# EAGLE design M105C (EAGLE 6.6.0)
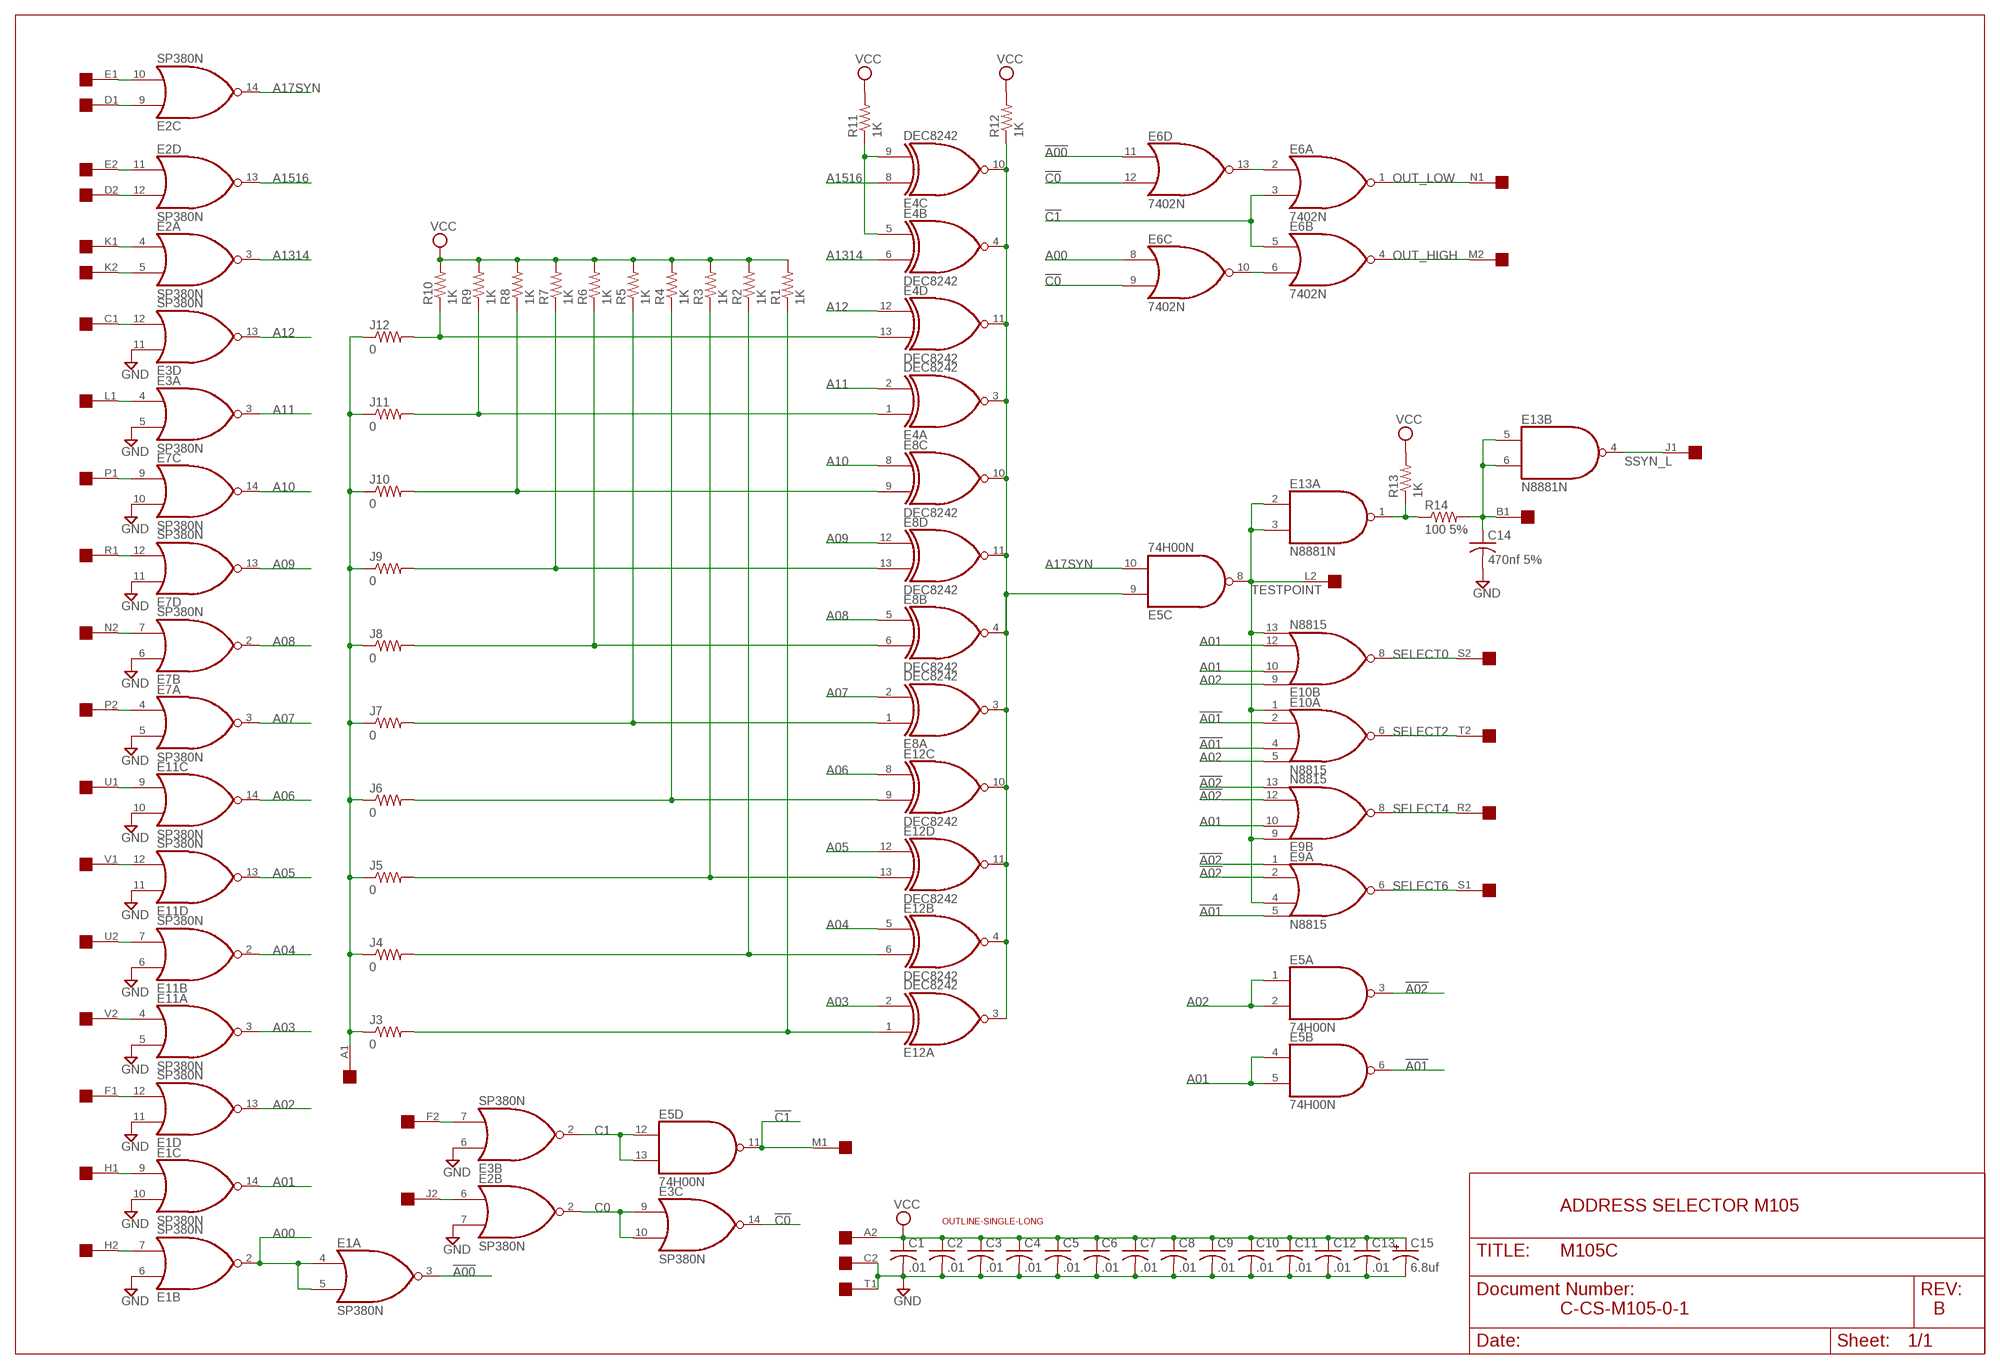
[diagram p0: schematic, sheet 1]

## Parts
C1  .01  C-US050-025X075  [C050-025X075]
C2  .01  C-US050-025X075  [C050-025X075]
C3  .01  C-US050-025X075  [C050-025X075]
C4  .01  C-US050-025X075  [C050-025X075]
C5  .01  C-US050-025X075  [C050-025X075]
C6  .01  C-US050-025X075  [C050-025X075]
C7  .01  C-US050-025X075  [C050-025X075]
C8  .01  C-US050-025X075  [C050-025X075]
C9  .01  C-US050-025X075  [C050-025X075]
C10  .01  C-US050-025X075  [C050-025X075]
C11  .01  C-US050-025X075  [C050-025X075]
C12  .01  C-US050-025X075  [C050-025X075]
C13  .01  C-US050-025X075  [C050-025X075]
C14  470nf 5%  C-US050-025X075  [C050-025X075]
C15  6.8uf  CPOL-USE15-5AXIAL  [E15-5]
E1  SP380N  [DIL14]
E2  SP380N  [DIL14]
E3  SP380N  [DIL14]
E4  DEC8242  74LS266N  [DIL14]
E5  74H00N  74S00N  [DIL14]
E6  7402N  [DIL14]
E7  SP380N  [DIL14]
E8  DEC8242  74LS266N  [DIL14]
E9  N8815  [DIL14]
E10  N8815  [DIL14]
E11  SP380N  [DIL14]
E12  DEC8242  74LS266N  [DIL14]
E13  N8881N  [DIL14]
J3  0  R-US_0207/10  [0207/10]
J4  0  R-US_0207/10  [0207/10]
J5  0  R-US_0207/10  [0207/10]
J6  0  R-US_0207/10  [0207/10]
J7  0  R-US_0207/10  [0207/10]
J8  0  R-US_0207/10  [0207/10]
J9  0  R-US_0207/10  [0207/10]
J10  0  R-US_0207/10  [0207/10]
J11  0  R-US_0207/10  [0207/10]
J12  0  R-US_0207/10  [0207/10]
R1  1K  R-US_0207/10  [0207/10]
R2  1K  R-US_0207/10  [0207/10]
R3  1K  R-US_0207/10  [0207/10]
R4  1K  R-US_0207/10  [0207/10]
R5  1K  R-US_0207/10  [0207/10]
R6  1K  R-US_0207/10  [0207/10]
R7  1K  R-US_0207/10  [0207/10]
R8  1K  R-US_0207/10  [0207/10]
R9  1K  R-US_0207/10  [0207/10]
R10  1K  R-US_0207/10  [0207/10]
R11  1K  R-US_0207/10  [0207/10]
R12  1K  R-US_0207/10  [0207/10]
R13  1K  R-US_0207/10  [0207/10]
R14  100 5%  R-US_0207/10  [0207/10]
U$1  SINGLE  [EDGE-CON2]
U$2  OUTLINE-SINGLE-LONG  [SINGLE-LONG]

## Nets
!A00: E1.3(A:O) E6.11(D:I0)
!A01: E5.6(B:O) E9.5(A:I3) E10.2(A:I1) E10.4(A:I2)
!A02: E5.3(A:O) E9.1(A:I0) E9.2(A:I1) E9.12(B:I2) E9.13(B:I3)
!C0: E3.14(C:O) E6.9(C:I1) E6.12(D:I1)
!C1: E5.11(D:O) E6.3(A:I1) E6.5(B:I0) U$1.M1
A00: E1.2(B:O) E1.4(A:I0) E1.5(A:I1) E6.8(C:I0)
A01: E1.14(C:O) E5.4(B:I0) E5.5(B:I1) E9.10(B:I1) E10.10(B:I1) E10.12(B:I2)
A02: E1.13(D:O) E5.1(A:I0) E5.2(A:I1) E10.5(A:I3) E10.9(B:I0)
A03: E11.3(A:O) E12.2(A:I1)
A04: E11.2(B:O) E12.5(B:I0)
A05: E11.13(D:O) E12.12(D:I0)
A06: E11.14(C:O) E12.8(C:I0)
A07: E7.3(A:O) E8.2(A:I1)
A08: E7.2(B:O) E8.5(B:I0)
A09: E7.13(D:O) E8.12(D:I0)
A10: E7.14(C:O) E8.8(C:I0)
A11: E3.3(A:O) E4.2(A:I1)
A12: E3.13(D:O) E4.12(D:I0)
A17SYN: E2.14(C:O) E5.10(C:I1)
A1314: E2.3(A:O) E4.6(B:I1)
A1516: E2.13(D:O) E4.8(C:I0)
C0: E2.2(B:O) E3.9(C:I0) E3.10(C:I1)
C1: E3.2(B:O) E5.12(D:I0) E5.13(D:I1)
GND [Supply]: C1.2 C2.2 C3.2 C4.2 C5.2 C6.2 C7.2 C8.2 C9.2 C10.2 C11.2 C12.2 C13.2 C14.2 C15.- E1.6(B:I0) E1.10(C:I1) E1.11(D:I0) E2.7(B:I1) E3.5(A:I1) E3.6(B:I0) E3.11(D:I0) E7.5(A:I1) E7.6(B:I0) E7.10(C:I1) E7.11(D:I0) E11.5(A:I1) E11.6(B:I0) E11.10(C:I1) E11.11(D:I0) U$1.C2 U$1.T1
N$1: E2.10(C:I1) U$1.E1
N$2: E2.9(C:I0) U$1.D1
N$3: E2.11(D:I0) U$1.E2
N$4: E2.12(D:I1) U$1.D2
N$5: E2.4(A:I0) U$1.K1
N$6: E2.5(A:I1) U$1.K2
N$7: E3.12(D:I1) U$1.C1
N$8: E3.4(A:I0) U$1.L1
N$9: E7.9(C:I0) U$1.P1
N$10: E7.7(B:I1) U$1.N2
N$11: E7.12(D:I1) U$1.R1
N$12: E7.4(A:I0) U$1.P2
N$13: E11.9(C:I0) U$1.U1
N$14: E11.12(D:I1) U$1.V1
N$15: E11.7(B:I1) U$1.U2
N$16: E11.4(A:I0) U$1.V2
N$17: E1.12(D:I1) U$1.F1
N$18: E1.7(B:I1) U$1.H2
N$19: E1.9(C:I0) U$1.H1
N$20: J3.1 J4.1 J5.1 J6.1 J7.1 J8.1 J9.1 J10.1 J11.1 J12.1 U$1.A1
N$21: E4.13(D:I1) J12.2 R10.1
N$22: E13.1(A:O) R13.1 R14.1
N$23: E2.6(B:I0) U$1.J2
N$24: E3.7(B:I1) U$1.F2
N$31: E4.1(A:I0) J11.2 R9.1
N$32: E4.5(B:I0) E4.9(C:I1) R11.1
N$33: E12.1(A:I0) J3.2 R1.1
N$34: E12.6(B:I1) J4.2 R2.1
N$35: E12.13(D:I1) J5.2 R3.1
N$36: E12.9(C:I1) J6.2 R4.1
N$37: E8.6(B:I1) J8.2 R6.1
N$38: E6.2(A:I0) E6.13(D:O)
N$39: E8.13(D:I1) J9.2 R7.1
N$40: E8.9(C:I1) J10.2 R8.1
N$41: E6.6(B:I1) E6.10(C:O)
N$43: E4.3(A:O) E4.4(B:O) E4.10(C:O) E4.11(D:O) E5.9(C:I0) E8.3(A:O) E8.4(B:O) E8.10(C:O) E8.11(D:O) E12.3(A:O) E12.4(B:O) E12.10(C:O) E12.11(D:O) R12.1
N$44: C14.1 E13.5(B:I0) E13.6(B:I1) R14.2 U$1.B1
N$48: E8.1(A:I0) J7.2 R5.1
OUT_HIGH: E6.4(B:O) U$1.M2
OUT_LOW: E6.1(A:O) U$1.N1
SELECT0: E10.8(B:O) U$1.S2
SELECT2: E10.6(A:O) U$1.T2
SELECT4: E9.8(B:O) U$1.R2
SELECT6: E9.6(A:O) U$1.S1
SSYN_L: E13.4(B:O) U$1.J1
TESTPOINT: E5.8(C:O) E9.4(A:I2) E9.9(B:I0) E10.1(A:I0) E10.13(B:I3) E13.2(A:I0) E13.3(A:I1) U$1.L2
VCC [Supply]: C1.1 C2.1 C3.1 C4.1 C5.1 C6.1 C7.1 C8.1 C9.1 C10.1 C11.1 C12.1 C13.1 C15.+ R1.2 R2.2 R3.2 R4.2 R5.2 R6.2 R7.2 R8.2 R9.2 R10.2 R11.2 R12.2 R13.2 U$1.A2
Unconnected: E13.8(C:I0) E13.9(C:I1) E13.10(C:O) E13.11(D:I0) E13.12(D:I1) E13.13(D:O) U$1.B2

## Notes on the sheet
- ADDRESS SELECTOR M105
- C-CS-M105-0-1 | B

## Power pins joined to a net without a drawn wire
GND: E1.1(P:GND) E2.1(P:GND) E3.1(P:GND) E4.7(P:GND) E5.7(P:GND) E6.7(P:GND) E7.1(P:GND) E8.7(P:GND) E9.7(P:GND) E10.7(P:GND) E11.1(P:GND) E12.7(P:GND) E13.7(P:GND)
VCC: E1.8(P:VCC) E2.8(P:VCC) E3.8(P:VCC) E4.14(P:VCC) E5.14(P:VCC) E6.14(P:VCC) E7.8(P:VCC) E8.14(P:VCC) E9.14(P:VCC) E10.14(P:VCC) E11.8(P:VCC) E12.14(P:VCC) E13.14(P:VCC)

## Library data of the parts
C1-C14 = rcl:C-US: CAPACITOR, American symbol
C15 = rcl:CPOL-US: POLARIZED CAPACITOR, American symbol
E1-E3 E7 E11 = dec-con:SP380: Quad NOR gate (use 8640)
E4 E8 E12 = 74xx-us:74*266: Quadruple EXCLUSIVE-NOR (XNOR), open-collector
E5 = 74xx-us:74*00: Quad 2-input NAND gate
E6 = 74xx-us:74*02: Quad 2-input NOR gate
E9 E10 = dec-con:N8815: Dual 4 Input NOR Gate
E13 = dec-con:N8881: Quad 2-input NAND gate, open collector
J3-J12 R1-R14 = rcl:R-US_: RESISTOR, American symbol
U$1 = dec-con:SINGLE: Single-Height DEC board
U$2 = dec-con:OUTLINE-*: Board outlines for DEC boards.

## Net classes
1 Supply: width 0.813 mm

## Board
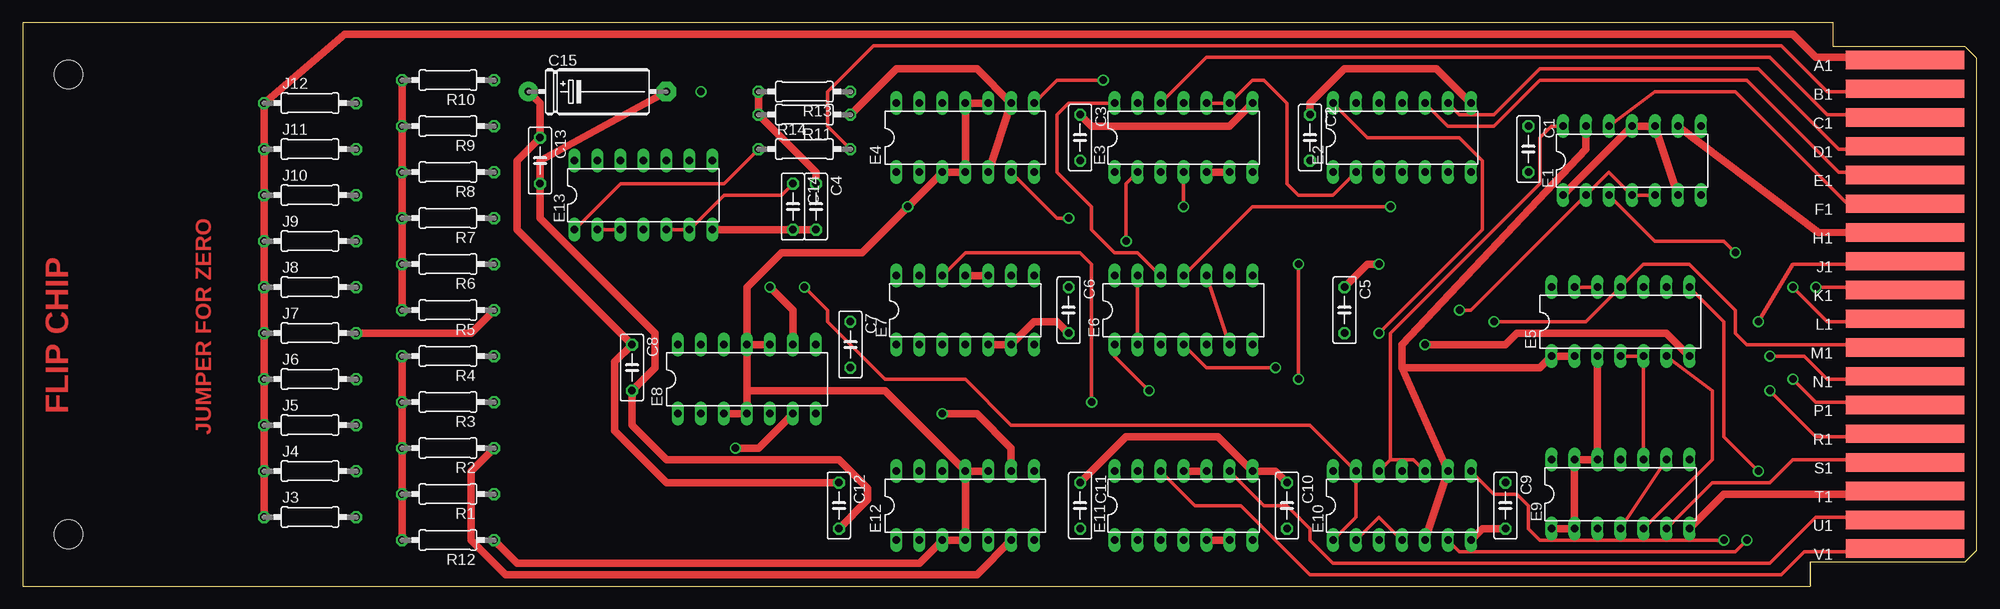
[diagram p1: board, top side]
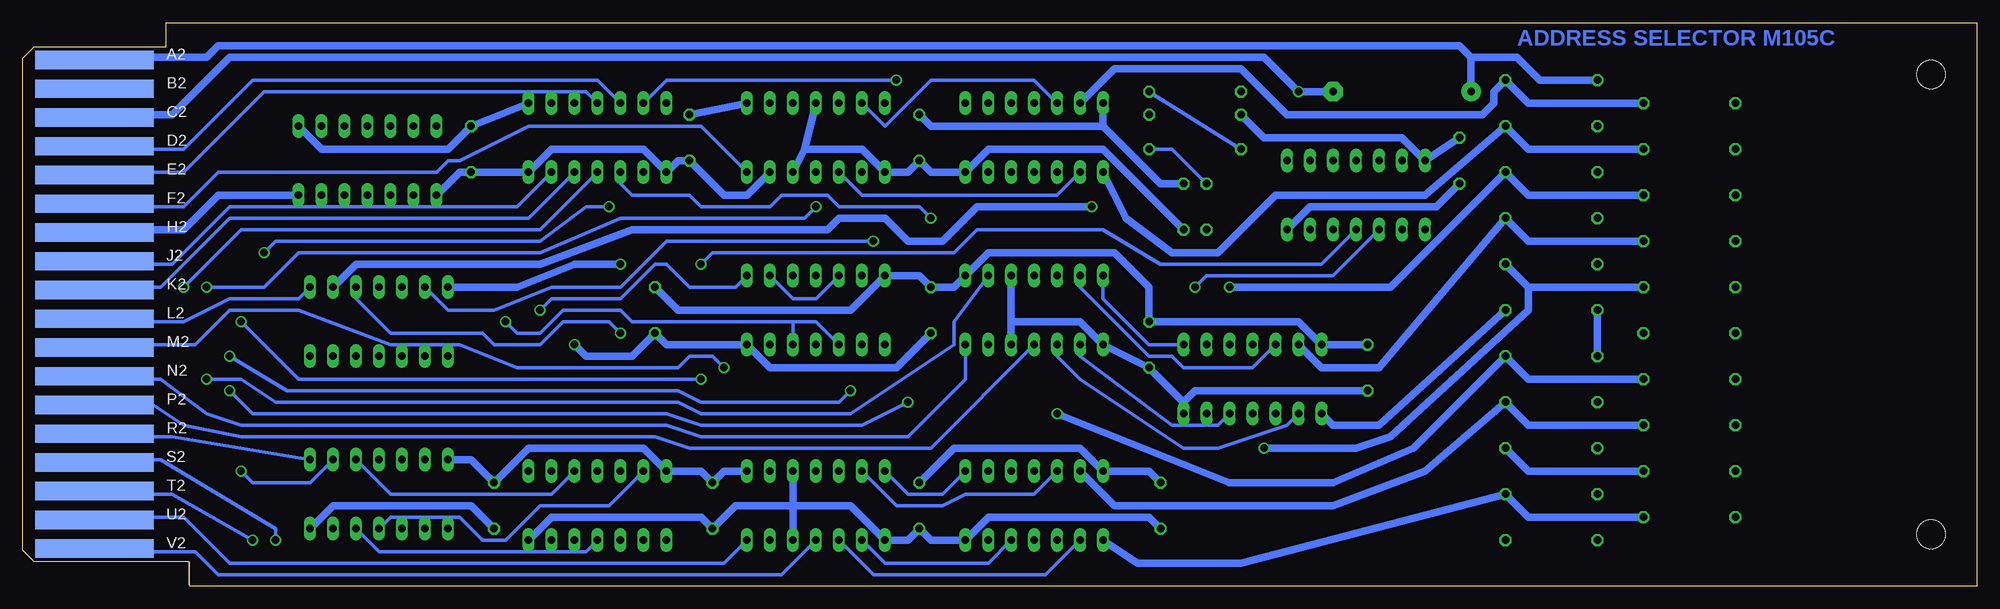
[diagram p2: board, bottom side, seen from below]

Size 215.9 x 62.23 mm. Coordinates in mm from the lower left corner, seen from the top.
Outline: 200.03,59.69 200.03,62.23
Copper layers (1+16): Top 0.035mm / dielectric 1.5mm / Bottom 0.035mm
Design rules "16mils": minimum track width 16mil, minimum drill 32mil, track to track 15mil, track to pad 10mil, pad to pad 10mil, via to via 10mil, smd to smd 10mil, copper to edge 13mil, drill to drill 10mil, minimum pad ring 10mil, minimum via ring 8mil, stop-mask expansion 0mil, vias tented up to drill 0mil, thermal gap 10mil

### Footprints (pad centres in the part's own frame; a part is rotated, then mirrored left to right if it is on the bottom)
C050-025X075 = drill 0.813 octagon: 1 -2.54,0; 2 2.54,0
E15-5 = drill 0.813 pad 2.159: + -7.62,0 | drill 0.813 pad 2.159 octagon: - 7.62,0
DIL14 = drill 0.813 long: 1 -7.62,-3.81; 2 -5.08,-3.81; 3 -2.54,-3.81; 4 0,-3.81; 5 2.54,-3.81; 6 5.08,-3.81; 7 7.62,-3.81; 8 7.62,3.81; 9 5.08,3.81; 10 2.54,3.81; 11 0,3.81; 12 -2.54,3.81; 13 -5.08,3.81; 14 -7.62,3.81
0207/10 = drill 0.813 octagon: 1 -5.08,0; 2 5.08,0
EDGE-CON2 = smd 13.106 x 2.032: A1 7.938,4.128; B1 7.938,7.303; C1 7.938,10.477; D1 7.938,13.652; E1 7.938,16.828; F1 7.938,20.003; H1 7.938,23.177; J1 7.938,26.352; K1 7.938,29.527; L1 7.938,32.703; M1 7.938,35.877; N1 7.938,39.053; P1 7.938,42.227; R1 7.938,45.403; S1 7.938,48.578; T1 7.938,51.752; U1 7.938,54.928; V1 7.938,58.102 | smd 13.106 x 2.032 bottom: A2 7.938,4.128; B2 7.938,7.303; C2 7.938,10.477; D2 7.938,13.652; E2 7.938,16.828; F2 7.938,20.003; H2 7.938,23.177; J2 7.938,26.352; K2 7.938,29.527; L2 7.938,32.703; M2 7.938,35.877; N2 7.938,39.053; P2 7.938,42.227; R2 7.938,45.403; S2 7.938,48.578; T2 7.938,51.752; U2 7.938,54.928; V2 7.938,58.102
SINGLE-LONG = hole 3.175: 210.82,56.515; 210.82,5.715

### Placement (x,y rotation side)
C1  166.37,48.26 270 top
C2  142.24,49.53 270 top
C3  116.84,49.53 270 top
C4  87.63,41.91 270 top
C5  146.05,30.48 270 top
C6  115.57,30.48 270 top
C7  91.44,26.67 270 top
C8  67.31,24.13 270 top
C9  163.83,8.89 270 top
C10  139.7,8.89 270 top
C11  116.84,8.89 270 top
C12  90.17,8.89 270 top
C13  57.15,46.99 270 top
C14  85.09,41.91 270 top
C15  63.5,54.61 0 top
E1  177.8,46.99 0 top
E2  152.4,49.53 0 top
E3  128.27,49.53 0 top
E4  104.14,49.53 0 top
E5  176.53,29.21 0 top
E6  128.27,30.48 0 top
E7  104.14,30.48 0 top
E8  80.01,22.86 0 top
E9  176.53,10.16 0 top
E10  152.4,8.89 0 top
E11  128.27,8.89 0 top
E12  104.14,8.89 0 top
E13  68.58,43.18 0 top
J3  31.75,7.62 0 top
J4  31.75,12.7 0 top
J5  31.75,17.78 0 top
J6  31.75,22.86 0 top
J7  31.75,27.94 0 top
J8  31.75,33.02 0 top
J9  31.75,38.1 0 top
J10  31.75,43.18 0 top
J11  31.75,48.26 0 top
J12  31.75,53.34 0 top
R1  46.99,10.16 180 top
R2  46.99,15.24 180 top
R3  46.99,20.32 180 top
R4  46.99,25.4 180 top
R5  46.99,30.48 180 top
R6  46.99,35.56 180 top
R7  46.99,40.64 180 top
R8  46.99,45.72 180 top
R9  46.99,50.8 180 top
R10  46.99,55.88 180 top
R11  86.36,52.07 180 top
R12  46.99,5.08 180 top
R13  86.36,54.61 180 top
R14  86.36,48.26 0 top
U$1  215.9,62.23 180 top
U$2  215.9,62.23 180 top
U$3  [FLIPCHIP]  0,0 0 top

### Tracks (layer width: path | path; a pad name or v marks a point on that pad's centre or on a via)
!A00  (via drill 0.81)
  Top 0.406: E6.11 135.89,41.91 v151.13,41.91 | E1.3 180.34,38.1 187.96,38.1 v189.23,36.83
  Bottom 0.406: v151.13,41.91 153.67,41.91 158.75,38.1 187.96,38.1 v189.23,36.83
!A01
  Top 0.406: E5.6 186.69,21.59 186.69,13.97 E9.5 | E10.2 149.86,7.62 E10.4
  Bottom 0.406: E10.4 153.67,3.81 176.53,3.81 E9.5
!A02
  Top 0.813: E9.1 E9.2 E9.13 E9.12 E5.3
!C0
  Top 0.406: E3.14 115.57,53.34 114.3,52.07 114.3,45.72 118.11,41.91 118.11,39.37 120.65,36.83 123.19,36.83 E6.12
  Bottom 0.406: E6.12 128.27,31.75 130.81,31.75 E6.9
!C1  (via drill 0.81)
  Top 0.406: U$1.M1 202.26,26.34 201.93,26.67 190.5,26.67 189.23,27.94 189.23,30.48 184.15,35.56 179.07,35.56 E5.11 172.72,29.21 v162.56,29.21
  Bottom 0.406: E6.3 128.27,29.21 130.81,29.21 | 130.81,29.21 E6.5 | 130.81,29.21 148.59,29.21 149.86,30.48 156.21,30.48 158.75,27.94 161.29,27.94 v162.56,29.21
A00  (via drill 0.81)
  Top 0.406: E1.5 E1.4 175.26,45.72 E1.2 160.02,30.48 v158.75,30.48
  Bottom 0.406: E6.8 137.16,33.02 142.24,33.02 144.78,35.56 146.05,35.56 149.86,31.75 157.48,31.75 v158.75,30.48
A01
  Top 0.406: E9.10 E5.5 E5.4 | E10.12 151.13,13.97 | 151.13,13.97 153.67,13.97 E10.10 | E1.14 168.91,50.8 167.64,49.53 167.64,44.45 151.13,27.94 151.13,13.97
  Bottom 0.406: E9.10 175.26,10.16 157.48,10.16 E10.10
A02
  Top 0.813: E5.2 E5.1 167.64,24.13 152.4,24.13 | 152.4,24.13 E10.9 E10.5 | E1.13 172.72,48.26 152.4,26.67 152.4,24.13
A03
  Bottom 0.406: E12.2 102.87,1.27 121.92,1.27 E11.3
A04
  Bottom 0.406: E12.5 109.22,2.54 120.65,2.54 E11.2
A05
  Bottom 0.406: E12.12 104.14,10.16 111.76,10.16 114.3,8.89 119.38,8.89 E11.13
A06
  Bottom 0.406: E12.8 114.3,10.16 118.11,10.16 E11.14
A07
  Bottom 0.406: E8.2 76.2,17.78 83.82,15.24 87.63,15.24 99.06,22.86 101.6,25.4 E7.3
A08
  Bottom 0.406: E8.5 83.82,17.78 88.9,17.78 99.06,25.4 E7.2
A09
  Bottom 0.406: E8.12 80.01,24.13 87.63,24.13 88.9,25.4 91.44,25.4 99.06,33.02 E7.13
A10
  Bottom 0.406: E8.8 91.44,26.67 96.52,31.75 E7.14
A11
  Bottom 0.406: E4.2 101.6,43.18 123.19,43.18 E3.3
A12
  Bottom 0.406: E4.12 104.14,55.88 115.57,55.88 120.65,50.8 E3.13
A17SYN  (via drill 0.81)
  Top 0.406: E2.14 148.59,49.53 158.75,49.53 161.29,46.99 161.29,39.37 v149.86,27.94
  Bottom 0.406: E5.10 179.07,31.75 175.26,27.94 165.1,27.94 163.83,26.67 158.75,26.67 156.21,29.21 151.13,29.21 v149.86,27.94
A1314  (via drill 0.81)
  Top 0.406: E4.6 114.3,40.64 v115.57,40.64
  Bottom 0.406: E2.3 149.86,44.45 148.59,43.18 142.24,43.18 140.97,41.91 133.35,41.91 132.08,43.18 127,43.18 125.73,41.91 116.84,41.91 v115.57,40.64
A1516  (via drill 0.81)
  Top 0.406: E4.8 114.3,55.88 v119.38,55.88
  Bottom 0.406: v119.38,55.88 144.78,55.88 E2.13
C0
  Top 0.406: E3.10 E3.9 135.89,55.88 137.16,55.88 139.7,53.34 139.7,44.45 140.97,43.18 144.78,43.18 E2.2
C1  (via drill 0.81)
  Top 0.406: E5.13 E5.12 | E3.2 121.92,44.45 v121.92,38.1
  Bottom 0.406: v121.92,38.1 144.78,38.1 149.86,33.02 157.48,33.02 163.83,30.48 168.91,30.48 E5.13
GND  (via drill 0.81)
  Top 0.813: C12.2 93.34,9.53 93.34,10.79 90.17,13.97 71.12,13.97 67.31,17.78 C8.2 69.85,24.13 69.85,27.94 57.15,40.64 C13.2 57.15,46.99 C15.- | C9.2 161.29,6.35 E10.7 | E11.5 E11.6 | E11.10 E11.11 | E7.10 E7.11 | E7.5 E7.6 111.76,29.21 114.3,29.21 C6.2 | E3.5 E3.6 | U$1.T1 202.26,10.49 201.93,10.16 187.96,10.16 E9.7 | C4.2 C14.2 E13.7 | E1.1 E1.11 E1.10 E1.6 | E5.7 181.61,27.94 165.1,27.94 163.83,26.67 v154.94,26.67
  Bottom 0.813: C9.2 166.37,8.89 181.61,8.89 E9.7 | C12.2 91.44,7.62 109.22,7.62 E12.7 115.57,5.08 C11.2 118.11,5.08 E11.1 124.46,8.89 130.81,8.89 | 130.81,8.89 E11.5 | 130.81,8.89 E11.10 | 130.81,8.89 137.16,8.89 C10.2 140.97,7.62 157.48,7.62 E10.7 | 106.68,29.21 E7.5 | 106.68,29.21 E7.10 | 129.54,48.26 E3.5 | 129.54,48.26 E3.11 | 87.63,20.32 86.36,21.59 C8.2 | 87.63,20.32 E8.7 | 87.63,20.32 C7.2 E7.1 99.06,29.21 106.68,29.21 | U$1.C2 207.01,52.07 199.39,52.07 193.04,58.42 78.74,58.42 v74.93,54.61 C15.- | E13.7 73.66,41.91 59.69,41.91 C13.2 | C4.2 96.52,48.26 109.22,48.26 E4.7 115.57,45.72 C3.2 118.11,45.72 E3.1 123.19,48.26 129.54,48.26 | C6.2 119.38,24.13 133.35,24.13 E6.7 144.78,26.67 C5.2 148.59,25.4 153.67,25.4 v154.94,26.67 | E3.6 135.89,43.18 138.43,43.18 C2.2 143.51,46.99 E2.1 147.32,48.26 157.48,48.26 E2.7 C1.2 167.64,45.72 E1.1
N$1
  Top 0.406: U$1.E1 202.26,45.39 201.93,45.72 200.66,45.72 190.5,55.88 167.64,55.88 162.56,50.8 157.48,50.8 E2.10
N$2
  Top 0.406: U$1.D1 202.9,48.56 201.93,48.26 200.66,48.26 191.77,57.15 167.64,57.15 162.56,52.07 158.75,52.07 E2.9
N$3
  Bottom 0.406: U$1.E2 206.07,45.39 205.74,45.72 198.12,45.72 189.23,54.61 153.67,54.61 E2.11
N$4
  Bottom 0.406: E2.12 152.4,55.88 190.5,55.88 198.12,48.26 207.01,48.26 207.31,48.56 U$1.D2
N$5  (via drill 0.81)
  Top 0.406: U$1.K1 202.24,32.72 201.93,33.02 v198.12,33.02
  Bottom 0.406: v198.12,33.02 191.77,39.37 158.75,39.37 E2.4
N$6
  Bottom 0.406: E2.5 160.02,40.64 193.04,40.64 200.66,33.02 207.01,33.02 207.31,32.72 U$1.K2
N$7
  Top 0.406: U$1.C1 202.26,51.74 201.93,52.07 199.39,52.07 193.04,58.42 130.81,58.42 E3.12
N$8  (via drill 0.81)
  Top 0.406: U$1.L1 202.26,29.54 201.93,29.21 199.39,29.21 v195.58,33.02 | v128.27,41.91 E3.4
  Bottom 0.406: v128.27,41.91 129.54,40.64 149.86,40.64 158.75,36.83 185.42,36.83 189.23,33.02 v195.58,33.02
N$9  (via drill 0.81)
  Top 0.406: U$1.P1 202.26,19.99 201.93,20.32 198.12,20.32 v195.58,22.86
  Bottom 0.406: v195.58,22.86 191.77,22.86 187.96,20.32 143.51,20.32 140.97,19.05 124.46,19.05 113.03,26.67 113.03,29.21 E7.9
N$10
  Bottom 0.406: U$1.N2 205.74,22.86 200.66,22.86 195.58,19.05 191.77,17.78 144.78,17.78 140.97,16.51 118.11,16.51 111.76,22.86 E7.7
N$11  (via drill 0.81)
  Top 0.406: U$1.R1 202.26,16.84 201.93,16.51 198.12,16.51 v193.04,21.59 | E7.12 104.14,36.83 116.84,36.83 118.11,35.56 v118.11,20.32
  Bottom 0.406: v193.04,21.59 190.5,19.05 144.78,19.05 140.97,17.78 123.19,17.78 v118.11,20.32
N$12
  Bottom 0.406: U$1.P2 207.34,19.99 207.01,20.32 201.93,20.32 198.12,17.78 191.77,16.51 146.05,16.51 142.24,15.24 115.57,15.24 E7.4
N$13
  Top 0.406: U$1.U1 202.29,7.26 201.93,7.62 198.12,7.62 193.04,2.54 144.78,2.54 142.24,5.08 142.24,6.35 139.7,8.89 137.16,8.89 E11.9
N$14
  Top 0.406: U$1.V1 202.32,4.2 201.93,3.81 196.85,3.81 194.31,1.27 142.24,1.27 134.62,8.89 129.54,8.89 E11.12
N$15
  Bottom 0.406: U$1.U2 207.37,7.26 207.01,7.62 198.12,7.62 193.04,2.54 138.43,2.54 E11.7
N$16
  Bottom 0.406: U$1.V2 207.4,4.2 207.01,3.81 196.85,3.81 194.31,1.27 132.08,1.27 E11.4
N$17
  Top 0.406: U$1.F1 202.21,42.19 201.93,41.91 189.23,54.61 180.34,54.61 E1.12
N$18
  Bottom 0.813: U$1.H2 207.34,39.04 207.01,39.37 198.12,39.37 194.31,43.18 E1.7
N$19
  Top 0.813: U$1.H1 198.45,39.04 E1.9
N$20
  Top 0.813: J3.1 J4.1 J5.1 J6.1 J7.1 J8.1 J9.1 J10.1 J11.1 J12.1 35.56,60.96 195.58,60.96 198.12,58.42 201.93,58.42 202.33,58.02 U$1.A1
N$21
  Bottom 0.813: J12.2 49.53,53.34 R10.1 53.34,54.61 53.34,53.34 54.61,52.07 76.2,52.07 81.28,57.15 95.25,57.15 E4.13
N$22
  Top 0.406: E13.1 66.04,44.45 77.47,44.45 R14.1
  Bottom 0.406: R14.1 R13.1
N$23
  Bottom 0.406: E2.6 161.29,41.91 193.04,41.91 199.39,35.56 207.01,35.56 207.34,35.89 U$1.J2
N$24
  Bottom 0.406: E3.7 140.97,50.8 160.02,50.8 167.64,46.99 168.91,46.99 170.18,45.72 194.31,45.72 198.12,41.91 207.01,41.91 207.29,42.19 U$1.F2
N$31
  Bottom 0.813: J11.2 49.53,48.26 R9.1 60.96,43.18 77.47,43.18 83.82,36.83 88.9,36.83 93.98,40.64 E4.1
N$32
  Top 0.813: R11.1 96.52,57.15 105.41,57.15 E4.9 E4.5
N$33
  Bottom 0.813: J3.2 49.53,7.62 R1.1 81.28,2.54 92.71,2.54 E12.1
N$34
  Top 0.813: R2.1 49.53,12.7 49.53,5.08 53.34,1.27 105.41,1.27 E12.6
  Bottom 0.813: J4.2 49.53,12.7 R2.1
N$35
  Bottom 0.813: J5.2 49.53,17.78 R3.1 60.96,12.7 71.12,8.89 95.25,8.89 E12.13
N$36  (via drill 0.81)
  Top 0.813: v101.6,19.05 105.41,19.05 109.22,15.24 E12.9
  Bottom 0.813: J6.2 49.53,22.86 R4.1 62.23,15.24 71.12,11.43 82.55,11.43 v101.6,19.05
N$37  (via drill 0.81)
  Top 0.813: v78.74,15.24 81.28,15.24 E8.6
  Bottom 0.813: J8.2 49.53,33.02 | 49.53,33.02 R6.1 | 49.53,33.02 49.53,30.48 64.77,16.51 68.58,15.24 v78.74,15.24
N$38
  Top 0.406: E6.2 E6.13
N$39
  Bottom 0.813: J9.2 49.53,38.1 R7.1 66.04,24.13 72.39,24.13 E8.13
N$40  (via drill 0.81)
  Top 0.813: v82.55,33.02 85.09,30.48 E8.9
  Bottom 0.813: J10.2 49.53,43.18 R8.1 64.77,33.02 v82.55,33.02
N$41
  Top 0.406: E6.6 E6.10
N$43  (via drill 0.81)
  Top 0.813: R12.1 54.61,2.54 99.06,2.54 E12.3 E12.4 E12.11 | E12.11 E12.10 | E8.11 E8.10 E8.11 | E8.3 E8.4 80.01,21.59 | E4.10 E4.11 E4.4 E4.3 v97.79,41.91 92.71,36.83 83.82,36.83 80.01,33.02 E8.11 | 80.01,21.59 E8.11 | E12.11 95.25,21.59 80.01,21.59
  Bottom 0.813: v97.79,41.91 110.49,41.91 114.3,38.1 118.11,38.1 120.65,40.64 125.73,40.64 127,39.37 148.59,39.37 158.75,35.56 179.07,35.56 E5.9
N$44
  Top 0.406: U$1.B1 202.22,54.9 201.93,54.61 199.39,54.61 194.31,59.69 93.98,59.69 88.9,54.61 88.9,50.8 R14.2 | E13.5 E13.6 77.47,43.18 83.82,43.18 C14.1
  Bottom 0.406: C14.1 88.9,48.26 R14.2
N$48
  Top 0.813: J7.2 49.53,27.94 R5.1
  Bottom 0.813: R5.1 66.04,17.78 71.12,17.78 E8.1
OUT_HIGH  (via drill 0.81)
  Top 0.406: v138.43,24.13 130.81,24.13 E6.4
  Bottom 0.406: U$1.M2 207.34,26.34 207.01,26.67 196.85,26.67 193.04,30.48 185.42,30.48 175.26,26.67 167.64,26.67 161.29,24.13 143.51,24.13 142.24,25.4 139.7,25.4 v138.43,24.13
OUT_LOW  (via drill 0.81)
  Top 0.406: U$1.N1 202.26,23.19 201.93,22.86 199.39,22.86 196.85,25.4 v193.04,25.4 | E6.1 120.65,25.4 v124.46,21.59
  Bottom 0.406: v193.04,25.4 186.69,21.59 143.51,21.59 140.97,20.32 125.73,20.32 v124.46,21.59
SELECT0  (via drill 0.81)
  Top 0.406: v187.96,5.08 167.64,5.08 166.37,6.35 166.37,8.89 165.1,10.16 162.56,10.16 E10.8
  Bottom 0.406: U$1.S2 202.24,13.66 201.93,13.97 200.66,13.97 187.96,6.35 v187.96,5.08
SELECT2  (via drill 0.81)
  Top 0.406: E10.6 158.75,3.81 189.23,3.81 v190.5,5.08
  Bottom 0.406: U$1.T2 202.26,10.49 201.93,10.16 199.39,10.16 v190.5,5.08
SELECT4
  Bottom 0.406: U$1.R2 207.34,16.84 207.01,16.51 199.39,16.51 E9.8
SELECT6
  Top 0.406: U$1.S1 202.24,13.66 201.93,13.97 195.58,13.97 193.04,11.43 186.69,11.43 E9.6
SSYN_L  (via drill 0.81)
  Top 0.406: U$1.J1 202.26,35.89 201.93,35.56 195.58,35.56 v191.77,29.21 | v140.97,35.56 v140.97,22.86
  Bottom 0.406: E13.4 72.39,35.56 90.17,35.56 96.52,39.37 110.49,39.37 113.03,36.83 139.7,36.83 v140.97,35.56 | v191.77,29.21 185.42,22.86 v140.97,22.86
TESTPOINT  (via drill 0.81)
  Top 0.406: E13.2 E13.3 | v86.36,33.02 88.9,30.48 88.9,29.21 95.25,22.86 104.14,22.86 109.22,17.78 142.24,17.78 E10.13 147.32,7.62 E10.1 | E9.4 E9.9 | v191.77,12.7 187.96,16.51 187.96,29.21 E5.8
  Bottom 0.406: E13.3 71.12,34.29 85.09,34.29 v86.36,33.02 | E9.4 175.26,7.62 167.64,7.62 165.1,5.08 162.56,5.08 158.75,8.89 151.13,8.89 E10.13 | E9.9 184.15,11.43 190.5,11.43 v191.77,12.7 | U$1.L2 206.07,29.54 205.74,29.21 198.12,29.21 193.04,31.75 185.42,31.75 E5.8
VCC  (via drill 0.81)
  Top 0.813: R12.2 R1.2 R2.2 R3.2 R4.2 | R5.2 R6.2 R7.2 R8.2 R9.2 R10.2 | C12.1 71.12,11.43 65.41,17.14 65.41,24.77 C8.1 54.61,39.37 54.61,46.99 C13.1 57.15,53.34 C15.+ | C11.1 121.92,16.51 132.08,16.51 E11.8 138.43,12.7 C10.1 | R13.2 R11.2 87.63,45.72 C4.1 | E2.8 156.21,57.15 146.05,57.15 142.24,53.34 C2.1 | v149.86,35.56 148.59,35.56 C5.1 | E3.8 133.35,50.8 118.11,50.8 C3.1
  Bottom 0.813: R5.2 R4.2 | C12.1 91.44,12.7 E12.14 99.06,15.24 113.03,15.24 C11.1 | E11.8 138.43,12.7 C10.1 140.97,12.7 E10.14 147.32,15.24 160.02,15.24 C9.1 166.37,13.97 E9.14 | C8.1 E8.14 74.93,29.21 C7.1 91.44,33.02 95.25,36.83 109.22,36.83 E7.8 113.03,33.02 C6.1 116.84,34.29 E6.14 124.46,30.48 143.51,30.48 C5.1 | 55.88,58.42 C15.+ | 55.88,58.42 50.8,58.42 48.26,55.88 R10.2 | U$1.A2 205.74,58.42 195.58,58.42 194.31,59.69 57.15,59.69 55.88,58.42 | C13.1 E13.14 63.5,49.53 78.74,49.53 R11.2 | C4.1 90.17,44.45 96.52,50.8 | 96.52,50.8 E4.14 | C3.1 115.57,50.8 96.52,50.8 | E5.14 161.29,33.02 154.94,35.56 v149.86,35.56 | E3.8 C2.1 | E2.8 C1.1 168.91,48.26 182.88,48.26 E1.8

### Text on the board
Top: JUMPER FOR ZERO
Bottom: ADDRESS SELECTOR M105C